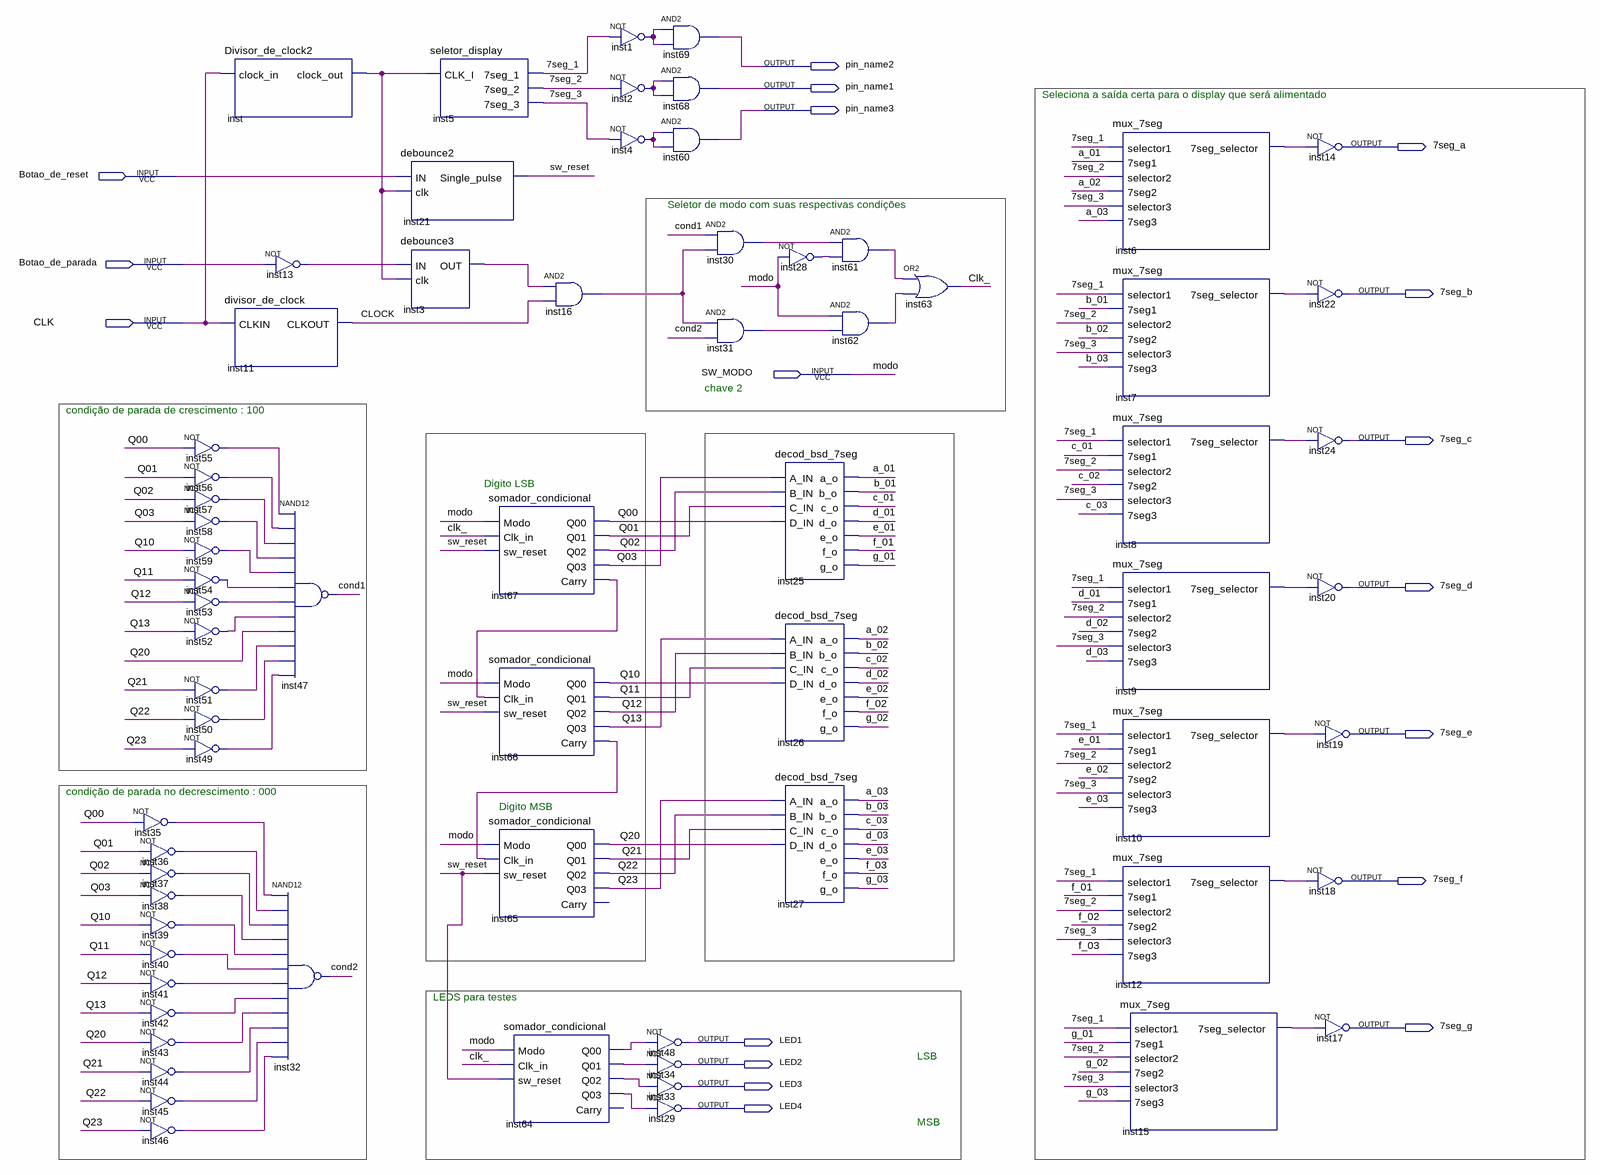
[diagram p0: schematic sheet]
// Quartus schematic projeto.bdf as structural Verilog: 69 symbols, 18 pins
module projeto (
  input  Botao_de_reset,
  input  Botao_de_parada,
  input  CLK,
  input  SW_MODO,
  output pin_name2,
  output pin_name1,
  output pin_name3,
  output \7seg_a ,
  output \7seg_b ,
  output \7seg_c ,
  output \7seg_d ,
  output \7seg_e ,
  output \7seg_f ,
  output \7seg_g ,
  output LED1,
  output LED2,
  output LED3,
  output LED4
);

  wire \7seg_1 , \7seg_2 , \7seg_3 , a_01, a_02, a_03, b_01, b_02, b_03, c_01, c_02, c_03, clk_, CLOCK,
       cond1, cond2, d_01, d_02, d_03, e_01, e_02, e_03, f_01, f_02, f_03, g_01, g_02, g_03, inst1_out,
       inst2_out, inst3_out, inst4_out, inst6_7seg_selector, inst7_7seg_selector, inst8_7seg_selector,
       inst9_7seg_selector, inst10_7seg_selector, inst12_7seg_selector, inst13_out, inst15_7seg_selector,
       inst16_out, inst28_out, inst30_out, inst31_out, inst35_out, inst36_out, inst37_out, inst38_out,
       inst39_out, inst40_out, inst41_out, inst42_out, inst43_out, inst44_out, inst45_out, inst46_out,
       inst49_out, inst50_out, inst51_out, inst52_out, inst53_out, inst54_out, inst55_out, inst56_out,
       inst57_out, inst58_out, inst59_out, inst61_out, inst62_out, inst64_q00, inst64_q01, inst64_q02,
       inst64_q03, inst66_carry, inst67_carry, inst_clock_out, Q00, Q01, Q02, Q03, Q10, Q11, Q12, Q13, Q20,
       Q21, Q22, Q23, sw_reset;

  not inst35 (inst35_out, Q00);
  not inst36 (inst36_out, Q01);
  not inst37 (inst37_out, Q02);
  not inst38 (inst38_out, Q03);
  not inst39 (inst39_out, Q10);
  not inst40 (inst40_out, Q11);
  not inst41 (inst41_out, Q12);
  not inst42 (inst42_out, Q13);
  not inst43 (inst43_out, Q20);
  not inst44 (inst44_out, Q21);
  not inst45 (inst45_out, Q22);
  not inst46 (inst46_out, Q23);
  not inst55 (inst55_out, Q00);
  not inst56 (inst56_out, Q01);
  not inst57 (inst57_out, Q02);
  not inst58 (inst58_out, Q03);
  not inst59 (inst59_out, Q10);
  not inst54 (inst54_out, Q11);
  not inst53 (inst53_out, Q12);
  not inst52 (inst52_out, Q13);
  not inst51 (inst51_out, Q21);
  not inst50 (inst50_out, Q22);
  not inst49 (inst49_out, Q23);
  Divisor_de_clock2 inst (.clock_in(CLK), .clock_out(inst_clock_out));
  not inst13 (inst13_out, Botao_de_parada);
  divisor_de_clock inst11 (.CLKIN(CLK), .CLKOUT(CLOCK));
  nand inst32 (cond2, inst35_out, inst36_out, inst37_out, inst38_out, inst39_out, inst40_out, inst41_out, inst42_out, inst43_out, inst44_out, inst45_out, inst46_out);
  nand inst47 (cond1, inst55_out, inst56_out, inst57_out, inst58_out, inst59_out, inst54_out, inst53_out, inst52_out, Q20, inst51_out, inst50_out, inst49_out);
  seletor_display inst5 (.CLK_I(inst_clock_out), .\7seg_1 (\7seg_1 ), .\7seg_2 (\7seg_2 ), .\7seg_3 (\7seg_3 ));
  debounce2 inst21 (.IN(Botao_de_reset), .clk(inst_clock_out), .Single_pulse(sw_reset));
  debounce3 inst3 (.IN(inst13_out), .clk(inst_clock_out), .OUT(inst3_out));
  somador_condicional inst67 (
    .Modo(SW_MODO), .Clk_in(clk_), .sw_reset(sw_reset), .Q00(Q00), .Q01(Q01), .Q02(Q02), .Q03(Q03),
    .Carry(inst67_carry));
  somador_condicional inst66 (
    .Modo(SW_MODO), .Clk_in(inst67_carry), .sw_reset(sw_reset), .Q00(Q10), .Q01(Q11), .Q02(Q12), .Q03(Q13),
    .Carry(inst66_carry));
  somador_condicional inst65 (
    .Modo(SW_MODO), .Clk_in(inst66_carry), .sw_reset(sw_reset), .Q00(Q20), .Q01(Q21), .Q02(Q22), .Q03(Q23));  // open: Carry
  somador_condicional inst64 (
    .Modo(SW_MODO), .Clk_in(clk_), .sw_reset(sw_reset), .Q00(inst64_q00), .Q01(inst64_q01), .Q02(inst64_q02),
    .Q03(inst64_q03));  // open: Carry
  and inst16 (inst16_out, inst3_out, CLOCK);
  not inst1 (inst1_out, \7seg_1 );
  not inst2 (inst2_out, \7seg_2 );
  not inst4 (inst4_out, \7seg_3 );
  and inst69 (pin_name2, inst1_out, inst1_out);
  and inst68 (pin_name1, inst2_out, inst2_out);
  and inst60 (pin_name3, inst4_out, inst4_out);
  not inst48 (LED1, inst64_q00);
  not inst34 (LED2, inst64_q01);
  not inst33 (LED3, inst64_q02);
  not inst29 (LED4, inst64_q03);
  and inst30 (inst30_out, cond1, inst16_out);
  and inst31 (inst31_out, inst16_out, cond2);
  not inst28 (inst28_out, SW_MODO);
  decod_bsd_7seg inst25 (
    .A_IN(Q03), .B_IN(Q02), .C_IN(Q01), .D_IN(Q00), .a_o(a_01), .b_o(b_01), .c_o(c_01), .d_o(d_01),
    .e_o(e_01), .f_o(f_01), .g_o(g_01));
  decod_bsd_7seg inst26 (
    .A_IN(Q13), .B_IN(Q12), .C_IN(Q11), .D_IN(Q10), .a_o(a_02), .b_o(b_02), .c_o(c_02), .d_o(d_02),
    .e_o(e_02), .f_o(f_02), .g_o(g_02));
  decod_bsd_7seg inst27 (
    .A_IN(Q23), .B_IN(Q22), .C_IN(Q21), .D_IN(Q20), .a_o(a_03), .b_o(b_03), .c_o(c_03), .d_o(d_03),
    .e_o(e_03), .f_o(f_03), .g_o(g_03));
  and inst61 (inst61_out, inst30_out, inst28_out);
  and inst62 (inst62_out, SW_MODO, inst31_out);
  or inst63 (clk_, inst61_out, inst62_out);
  mux_7seg inst6 (
    .selector1(\7seg_1 ), .\7seg1 (a_01), .selector2(\7seg_2 ), .\7seg2 (a_02), .selector3(\7seg_3 ),
    .\7seg3 (a_03), .\7seg_selector (inst6_7seg_selector));
  mux_7seg inst7 (
    .selector1(\7seg_1 ), .\7seg1 (b_01), .selector2(\7seg_2 ), .\7seg2 (b_02), .selector3(\7seg_3 ),
    .\7seg3 (b_03), .\7seg_selector (inst7_7seg_selector));
  mux_7seg inst8 (
    .selector1(\7seg_1 ), .\7seg1 (c_01), .selector2(\7seg_2 ), .\7seg2 (c_02), .selector3(\7seg_3 ),
    .\7seg3 (c_03), .\7seg_selector (inst8_7seg_selector));
  mux_7seg inst9 (
    .selector1(\7seg_1 ), .\7seg1 (d_01), .selector2(\7seg_2 ), .\7seg2 (d_02), .selector3(\7seg_3 ),
    .\7seg3 (d_03), .\7seg_selector (inst9_7seg_selector));
  mux_7seg inst10 (
    .selector1(\7seg_1 ), .\7seg1 (e_01), .selector2(\7seg_2 ), .\7seg2 (e_02), .selector3(\7seg_3 ),
    .\7seg3 (e_03), .\7seg_selector (inst10_7seg_selector));
  mux_7seg inst12 (
    .selector1(\7seg_1 ), .\7seg1 (f_01), .selector2(\7seg_2 ), .\7seg2 (f_02), .selector3(\7seg_3 ),
    .\7seg3 (f_03), .\7seg_selector (inst12_7seg_selector));
  mux_7seg inst15 (
    .selector1(\7seg_1 ), .\7seg1 (g_01), .selector2(\7seg_2 ), .\7seg2 (g_02), .selector3(\7seg_3 ),
    .\7seg3 (g_03), .\7seg_selector (inst15_7seg_selector));
  not inst14 (\7seg_a , inst6_7seg_selector);
  not inst22 (\7seg_b , inst7_7seg_selector);
  not inst24 (\7seg_c , inst8_7seg_selector);
  not inst20 (\7seg_d , inst9_7seg_selector);
  not inst19 (\7seg_e , inst10_7seg_selector);
  not inst18 (\7seg_f , inst12_7seg_selector);
  not inst17 (\7seg_g , inst15_7seg_selector);

  // Other names for the same wires on the sheet: modo = SW_MODO

  // Notes on the sheet:
  //   Seleciona a saída certa para o display que será alimentado
  //   Seletor de modo com suas respectivas condições
  //   chave 2
  //   condição de parada de crescimento : 100
  //   Digito LSB
  //   condição de parada no decrescimento : 000
  //   Digito MSB
  //   LEDS para testes
  //   LSB
  //   MSB
endmodule
